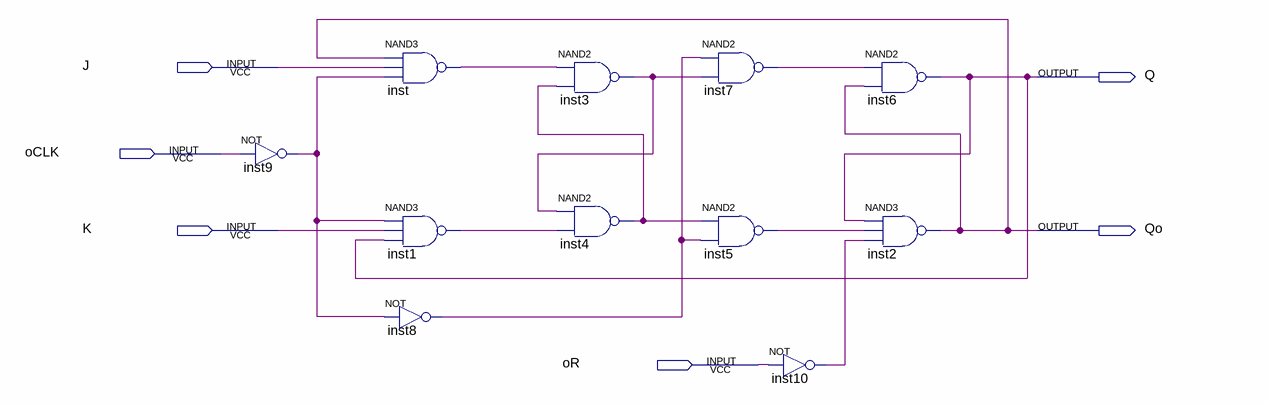
[diagram p0: schematic sheet]
// Quartus schematic FlipFlop_JK_oR.bdf as structural Verilog: 11 symbols, 6 pins
module FlipFlop_JK_oR (
  input  J,
  input  oCLK,
  input  K,
  input  oR,
  output Q,
  output Qo
);

  wire inst1_out, inst3_out, inst4_out, inst5_out, inst7_out, inst8_out, inst9_out, inst10_out, inst_out;

  not inst9 (inst9_out, oCLK);
  nand inst (inst_out, Qo, J, inst9_out);
  nand inst1 (inst1_out, inst9_out, K, Q);
  not inst8 (inst8_out, inst9_out);
  nand inst3 (inst3_out, inst_out, inst4_out);
  nand inst4 (inst4_out, inst3_out, inst1_out);
  nand inst7 (inst7_out, inst8_out, inst3_out);
  nand inst5 (inst5_out, inst4_out, inst8_out);
  not inst10 (inst10_out, oR);
  nand inst6 (Q, inst7_out, Qo);
  nand inst2 (Qo, Q, inst5_out, inst10_out);
endmodule
